# Altium schematic sheet CONTROLS.SchDoc
size A4; SheetNumber: 2; SheetTotal: 5
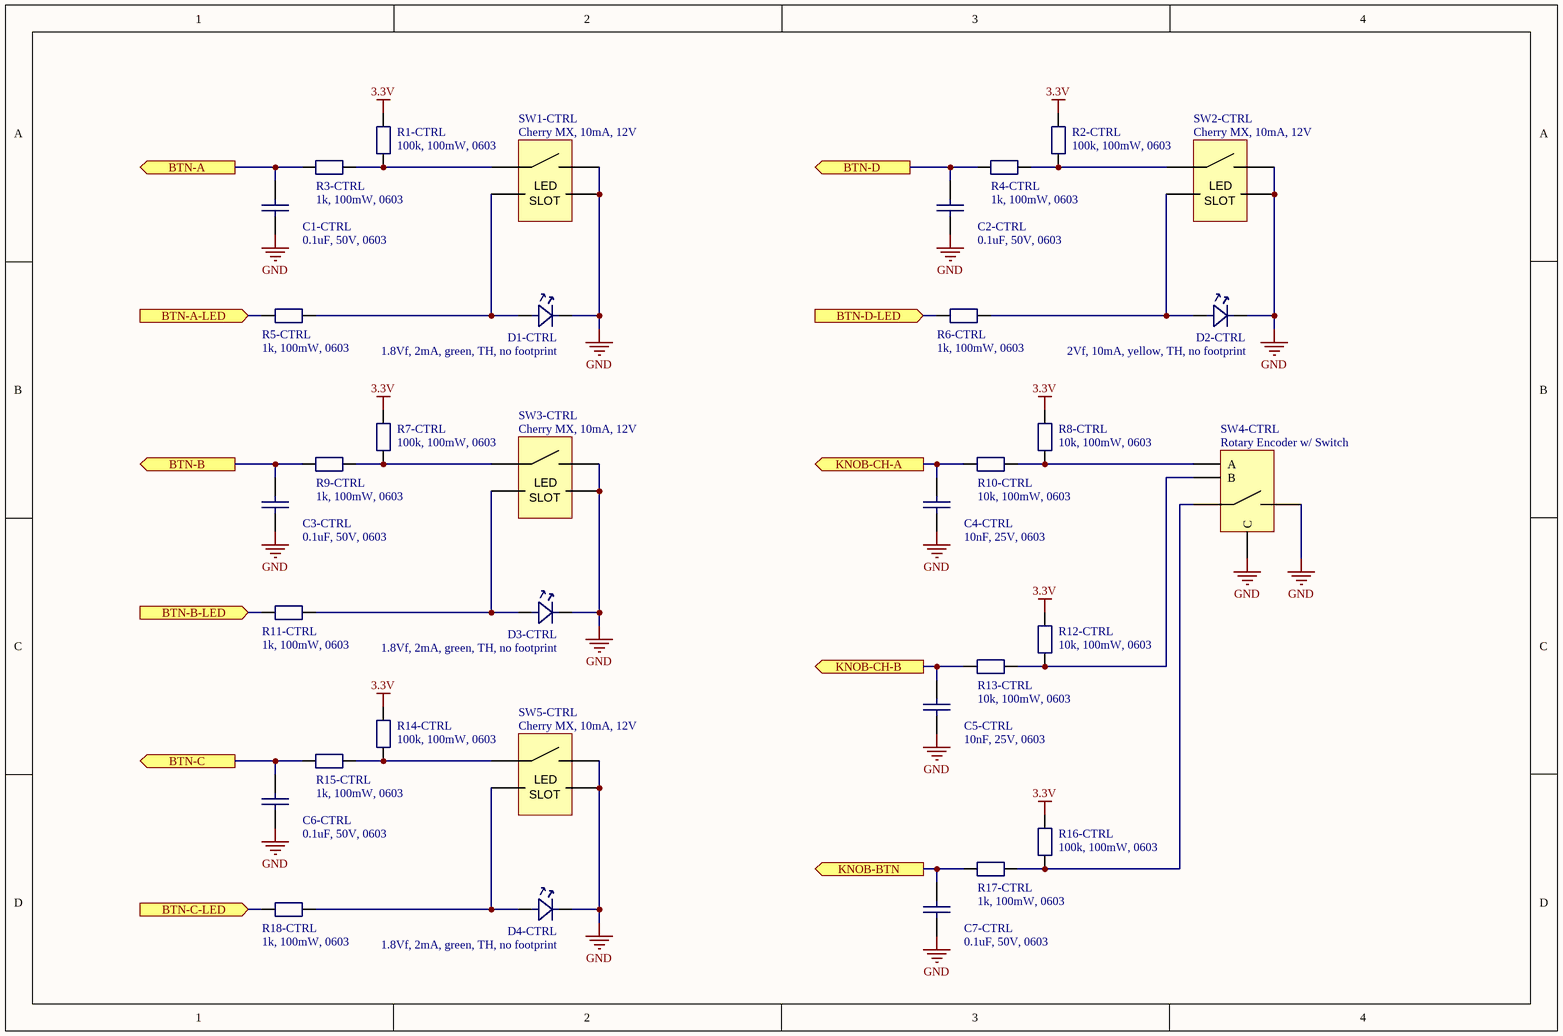
[diagram p0: CONTROLS.SchDoc]

## Parts
C1-CTRL  0.1uF, 50V, 0603  [0603 [1608]]
C2-CTRL  0.1uF, 50V, 0603  [0603 [1608]]
C3-CTRL  0.1uF, 50V, 0603  [0603 [1608]]
C4-CTRL  10nF, 25V, 0603  [0603 [1608]]
C5-CTRL  10nF, 25V, 0603  [0603 [1608]]
C6-CTRL  0.1uF, 50V, 0603  [0603 [1608]]
C7-CTRL  0.1uF, 50V, 0603  [0603 [1608]]
D1-CTRL  1.8Vf, 2mA, green, TH, no footprint  [LED 0603 [1608]]  (mechanical)
D2-CTRL  2Vf, 10mA, yellow, TH, no footprint  [LED 0603 [1608]]  (mechanical)
D3-CTRL  1.8Vf, 2mA, green, TH, no footprint  [LED 0603 [1608]]  (mechanical)
D4-CTRL  1.8Vf, 2mA, green, TH, no footprint  [LED 0603 [1608]]  (mechanical)
R1-CTRL  100k, 100mW, 0603  [0603 [1608]]
R2-CTRL  100k, 100mW, 0603  [0603 [1608]]
R3-CTRL  1k, 100mW, 0603  [0603 [1608]]
R4-CTRL  1k, 100mW, 0603  [0603 [1608]]
R5-CTRL  1k, 100mW, 0603  [0603 [1608]]
R6-CTRL  1k, 100mW, 0603  [0603 [1608]]
R7-CTRL  100k, 100mW, 0603  [0603 [1608]]
R8-CTRL  10k, 100mW, 0603  [0603 [1608]]
R9-CTRL  1k, 100mW, 0603  [0603 [1608]]
R10-CTRL  10k, 100mW, 0603  [0603 [1608]]
R11-CTRL  1k, 100mW, 0603  [0603 [1608]]
R12-CTRL  10k, 100mW, 0603  [0603 [1608]]
R13-CTRL  10k, 100mW, 0603  [0603 [1608]]
R14-CTRL  100k, 100mW, 0603  [0603 [1608]]
R15-CTRL  1k, 100mW, 0603  [0603 [1608]]
R16-CTRL  100k, 100mW, 0603  [0603 [1608]]
R17-CTRL  1k, 100mW, 0603  [0603 [1608]]
R18-CTRL  1k, 100mW, 0603  [0603 [1608]]
SW1-CTRL  Cherry MX, 10mA, 12V  [Cherry MX Switch]
SW2-CTRL  Cherry MX, 10mA, 12V  [Cherry MX Switch]
SW3-CTRL  Cherry MX, 10mA, 12V  [Cherry MX Switch]
SW4-CTRL  Rotary Encoder w/ Switch  [Rotary Encoder w/ Switch (Bourns)]
SW5-CTRL  Cherry MX, 10mA, 12V  [Cherry MX Switch]

## Ports
BTN-A (out, see OVERVIEW[2A], MCU[1A]), BTN-A-LED (in, see OVERVIEW[1A], MCU[1A]), BTN-B (out, see OVERVIEW[2A], MCU[1A]), BTN-B-LED (in, see OVERVIEW[1A], MCU[1A]), BTN-C (out, see OVERVIEW[2A], MCU[1A]), BTN-C-LED (in, see OVERVIEW[1A], MCU[1A]), BTN-D (out, see OVERVIEW[2A], MCU[2A]), BTN-D-LED (in, see OVERVIEW[1A], MCU[2A]), KNOB-BTN (out, see OVERVIEW[2B], MCU[1A]), KNOB-CH-A (out, see OVERVIEW[2B], MCU[1B]), KNOB-CH-B (out, see OVERVIEW[2B], MCU[1A])

## Nets
3.3V: R1-CTRL.2 R2-CTRL.2 R7-CTRL.2 R8-CTRL.2 R12-CTRL.2 R14-CTRL.2 R16-CTRL.2
GND: C1-CTRL.1 C2-CTRL.1 C3-CTRL.1 C4-CTRL.1 C5-CTRL.1 C6-CTRL.1 C7-CTRL.1 D1-CTRL.1 D2-CTRL.1 D3-CTRL.1 D4-CTRL.1 SW1-CTRL.2 SW1-CTRL.4 SW2-CTRL.2 SW2-CTRL.4 SW3-CTRL.2 SW3-CTRL.4 SW4-CTRL.2 SW4-CTRL.C SW5-CTRL.2 SW5-CTRL.4
BTN-A: C1-CTRL.2 R3-CTRL.2 ; port BTN-A
BTN-A-LED: R5-CTRL.1 ; port BTN-A-LED
BTN-B: C3-CTRL.2 R9-CTRL.2 ; port BTN-B
BTN-B-LED: R11-CTRL.1 ; port BTN-B-LED
BTN-C: C6-CTRL.2 R15-CTRL.2 ; port BTN-C
BTN-C-LED: R18-CTRL.1 ; port BTN-C-LED
BTN-D: C2-CTRL.2 R4-CTRL.2 ; port BTN-D
BTN-D-LED: R6-CTRL.1 ; port BTN-D-LED
KNOB-BTN: C7-CTRL.2 R17-CTRL.2 ; port KNOB-BTN
KNOB-CH-A: C4-CTRL.2 R10-CTRL.2 ; port KNOB-CH-A
KNOB-CH-B: C5-CTRL.2 R13-CTRL.2 ; port KNOB-CH-B
NetD1-CTRL_2: D1-CTRL.2 R5-CTRL.2 SW1-CTRL.3
NetD2-CTRL_2: D2-CTRL.2 R6-CTRL.2 SW2-CTRL.3
NetD3-CTRL_2: D3-CTRL.2 R11-CTRL.2 SW3-CTRL.3
NetD4-CTRL_2: D4-CTRL.2 R18-CTRL.2 SW5-CTRL.3
NetR1-CTRL_1: R1-CTRL.1 R3-CTRL.1 SW1-CTRL.1
NetR2-CTRL_1: R2-CTRL.1 R4-CTRL.1 SW2-CTRL.1
NetR7-CTRL_1: R7-CTRL.1 R9-CTRL.1 SW3-CTRL.1
NetR8-CTRL_1: R8-CTRL.1 R10-CTRL.1 SW4-CTRL.A
NetR12-CTRL_1: R12-CTRL.1 R13-CTRL.1 SW4-CTRL.B
NetR14-CTRL_1: R14-CTRL.1 R15-CTRL.1 SW5-CTRL.1
NetR16-CTRL_1: R16-CTRL.1 R17-CTRL.1 SW4-CTRL.1

## Notes on the sheet
- (in symbol Cherry MX Switch) LED; SLOT

## Library data of the parts
C1-CTRL C2-CTRL C3-CTRL C6-CTRL C7-CTRL = Capacitor: Manufacturer: MULTICOMP PRO; Manufacturer ID: MC0603B104J500CT; Supplier: Farnell; Supplier ID: 2320803; URL: https://ee.farnell.com/multicomp/mc0603b104j500ct/cap-0-1-f-50v-5-x7r-0603/dp/2320803?st=100%20nf
C4-CTRL C5-CTRL = Capacitor: Manufacturer: YAGEO; Manufacturer ID: CC0603KRX7R8BB103; Supplier: Farnell; Supplier ID: 3019561; URL: https://ee.farnell.com/yageo/cc0603krx7r8bb103/cap-0-01-f-25v-10-x7r-0603/dp/3019561
D1-CTRL D3-CTRL D4-CTRL = LED: Manufacturer: MULTICOMP PRO; Manufacturer ID: MP008246; Supplier: Farnell; Supplier ID: 3796272; URL: https://ee.farnell.com/multicomp-pro/mp008246/led-green-1-5mcd-572nm-3mm/dp/3796272?st=led%203mm
D2-CTRL = LED: Manufacturer: BROADCOM; Manufacturer ID: HLMP-1401; Supplier: Farnell; Supplier ID: 1003198; URL: https://ee.farnell.com/broadcom-limited/hlmp-1401/led-3mm-yellow-2-2mcd-585nm/dp/1003198
R1-CTRL R2-CTRL R7-CTRL R14-CTRL R16-CTRL = Resistor: Manufacturer: YAGEO; Manufacturer ID: RC0603FR-13100KL; Supplier: Farnell; Supplier ID: 2309107; URL: https://ee.farnell.com/yageo/rc0603fr-13100kl/res-100k-1-0-1w-0603-thick-film/dp/2309107
R3-CTRL R4-CTRL R5-CTRL R6-CTRL R9-CTRL R11-CTRL R15-CTRL R17-CTRL R18-CTRL = Resistor: Manufacturer: BOURNS; Manufacturer ID: CR0603-FX-1001ELF; Supplier: Farnell; Supplier ID: 2008335; URL: https://ee.farnell.com/bourns/cr0603-fx-1001elf/res-1k-1-0-1w-0603-thick-film/dp/2008335
R8-CTRL R10-CTRL R12-CTRL R13-CTRL = Resistor: Manufacturer: YAGEO; Manufacturer ID: RC0603FR-0710KL; Supplier: Farnell; Supplier ID: 9238603; URL: https://ee.farnell.com/yageo/rc0603fr-0710kl/res-10k-1-0-1w-0603-thick-film/dp/9238603
SW1-CTRL SW2-CTRL SW3-CTRL SW5-CTRL = Cherry MX Switch: Manufacturer: Cherry Americas LLC; Manufacturer ID: MX1A-11NW; Supplier: Digi-Key; Supplier ID: CH160-ND; URL: https://www.digikey.ee/en/products/detail/cherry-americas-llc/MX1A-11NW/91134
SW4-CTRL = Rotary Encoder w/ Switch: Manufacturer: Bourns; Manufacturer ID: PEC11H-4015F-S0016; Supplier: Digi-Key; Supplier ID: 118-PEC11H-4015F-S0016-ND; URL: https://www.digikey.ee/en/products/detail/bourns-inc/PEC11H-4015F-S0016/12349530